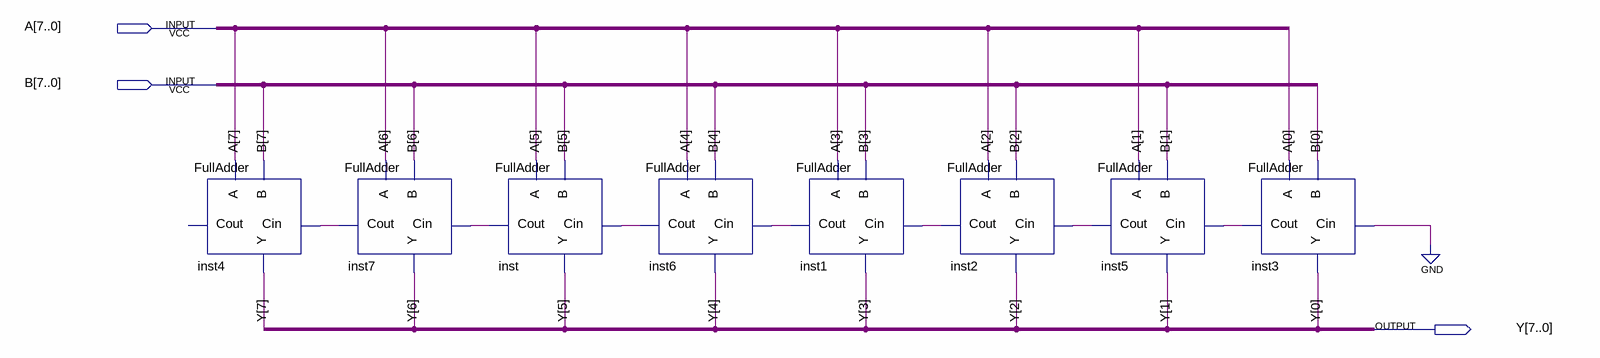
[diagram p0: schematic sheet]
// Quartus schematic fullAdder8bits.bdf as structural Verilog: 8 symbols, 3 pins
module fullAdder8bits (
  input  [7:0] A,
  input  [7:0] B,
  output [7:0] Y
);

  wire inst1_cout, inst2_cout, inst3_cout, inst5_cout, inst6_cout, inst7_cout, inst_cout;

  FullAdder inst4 (.A(A[7]), .B(B[7]), .Cin(inst7_cout), .Y(Y[7]));  // open: Cout
  FullAdder inst7 (.A(A[6]), .B(B[6]), .Cin(inst_cout), .Y(Y[6]), .Cout(inst7_cout));
  FullAdder inst (.A(A[5]), .B(B[5]), .Cin(inst6_cout), .Y(Y[5]), .Cout(inst_cout));
  FullAdder inst6 (.A(A[4]), .B(B[4]), .Cin(inst1_cout), .Y(Y[4]), .Cout(inst6_cout));
  FullAdder inst1 (.A(A[3]), .B(B[3]), .Cin(inst2_cout), .Y(Y[3]), .Cout(inst1_cout));
  FullAdder inst2 (.A(A[2]), .B(B[2]), .Cin(inst5_cout), .Y(Y[2]), .Cout(inst2_cout));
  FullAdder inst5 (.A(A[1]), .B(B[1]), .Cin(inst3_cout), .Y(Y[1]), .Cout(inst5_cout));
  FullAdder inst3 (.A(A[0]), .B(B[0]), .Cin(1'b0), .Y(Y[0]), .Cout(inst3_cout));
endmodule
